# Altium project 学习型红外转发器.PrjPcb
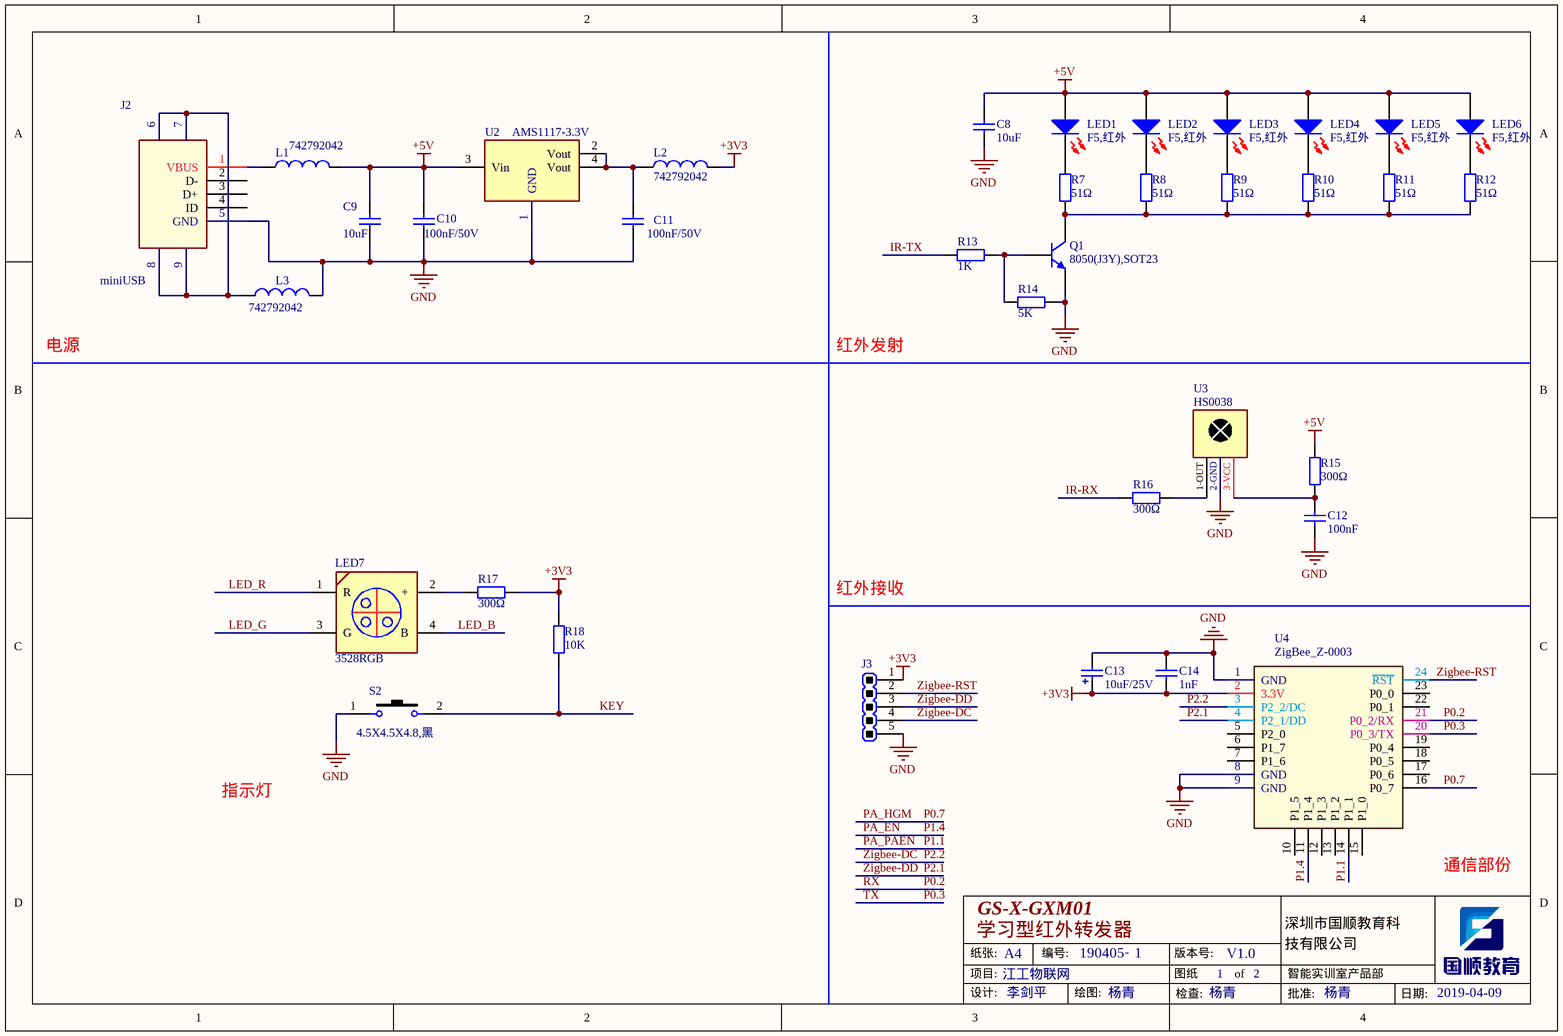
[diagram p0: 学习型红外转发器.SchDoc]
2 sheets, 53 parts. Net scope: global (net labels, ports and power ports of the same name join across sheets).
Board file: 学习型红外转发器.PcbDoc
Sheets:
  学习型红外转发器.SchDoc
  学习型红外转发器-MCU.SchDoc

## Sheet 学习型红外转发器.SchDoc: 学习型红外转发器
size A4; Organization: 智能实训室产品部; Address1: 广东省深圳市; Address2: 宝安区石岩凯普达工业园; DocumentNumber: 190405; Revision: V1.0; SheetNumber: 1; SheetTotal: 2; Date: 2019-04-09; ApprovedBy: 杨青; CheckedBy: 杨青; DrawnBy: 杨青; Engineer: 李剑平; ProjectName_GTA: 江工物联网; PCB Number: GS-X-GXM01

### Parts
C8  10uF  [C0603]
C9  10uF  [C0603]
C10  100nF/50V  [C0603]
C11  100nF/50V  [C0603]
C12  100nF  [C0603]
C13  10uF/25V  [TC3528X21B]
C14  1nF  [C0603]
J2  miniUSB  [USB mini/SM0.8-6H5]
J3  HDRM-1*5-2.54-AK  [HDRM-2.54-1*5P-AK1]  (value not drawn)  (no BOM)
L1  742792042  [L0805]
L2  742792042  [L0805]
L3  742792042  [L0805]
LED1  F5,红外  [IR-F5-V]
LED2  F5,红外  [IR-F5-V]
LED3  F5,红外  [IR-F5-V]
LED4  F5,红外  [IR-F5-V]
LED5  F5,红外  [IR-F5-V]
LED6  F5,红外  [IR-F5-V]
LED7  3528RGB  [LED_3528RGB]
Q1  8050(J3Y),SOT23  [SOT23]
R7  51Ω  [R0603]
R8  51Ω  [R0603]
R9  51Ω  [R0603]
R10  51Ω  [R0603]
R11  51Ω  [R0603]
R12  51Ω  [R0603]
R13  1K  [R0603]
R14  5K  [R0603]
R15  300Ω  [R0603]
R16  300Ω  [R0603]
R17  300Ω  [R0603]
R18  10K  [R0603]
S2  4.5X4.5X4.8,黑  [SW2-4.5*4.5*4.8MM-Side-BK]
U2  AMS1117-3.3V  [SOT-223]
U3  HS0038  [HS0038-H]
U4  ZigBee_Z-0003  [Module_ZigBee_Z-0003]

### Nets
+3V3: C13.1 C14.1 J3.1 L2.2 R17.1 R18.1 U4.2(3.3V)
+5V: C8.1 C9.1 C10.1 L1.2 LED1.1(A) LED2.1(A) LED3.1(A) LED4.1(A) LED5.1(A) LED6.1(A) R15.2 U2.3(Vin)
GND: C8.2 C9.2 C10.2 C11.2 C12.2 C13.2 C14.2 J2.5(GND) J3.5 L3.2 Q1.2(E) R14.2 S2.1 U2.1(GND) U3.2(GND) U4.1(GND) U4.8(GND) U4.9(GND)
IR-RX: R16.1
IR-TX: R13.1
KEY: R18.2 S2.2
LED_B: LED7.4(B)
LED_G: LED7.3(G)
LED_R: LED7.1(R)
P0.2: U4.21(P0_2/RX)  [also labelled RX]
P0.3: U4.20(P0_3/TX)  [also labelled TX]
P0.7: U4.16(P0_7)  [also labelled PA_HGM]
P1.1: U4.14(P1_1)  [also labelled PA_PAEN]
P1.4: U4.11(P1_4)  [also labelled PA_EN]
P2.1: J3.3 U4.4(P2_1/DD)  [also labelled Zigbee-DD]
P2.2: J3.4 U4.3(P2_2/DC)  [also labelled Zigbee-DC]
Zigbee-RST: J3.2 U4.24(~{RST})
NetC11_1: C11.1 L2.1 U2.2(Vout) U2.4(Vout)
NetC12_1: C12.1 R15.1 U3.3(VCC)
NetJ2_1: J2.1(VBUS) L1.1
NetJ2_6: J2.6 J2.7 J2.8 J2.9 L3.1
NetLED1_2: LED1.2(K) R7.2
NetLED2_2: LED2.2(K) R8.2
NetLED3_2: LED3.2(K) R9.2
NetLED4_2: LED4.2(K) R10.2
NetLED5_2: LED5.2(K) R11.2
NetLED6_2: LED6.2(K) R12.2
NetLED7_2: LED7.2(+) R17.2
NetQ1_1: Q1.1(B) R13.2 R14.1
NetQ1_3: Q1.3(C) R7.1 R8.1 R9.1 R10.1 R11.1 R12.1
NetR16_2: R16.2 U3.1(out)

Not connected (* = marked no-connect by the designer): J2 2(D-) 3(D+) 4(ID); U4 5(P2_0) 6(P1_7) 7(P1_6) 10(P1_5) 12(P1_3) 13(P1_2) 15(P1_0) 17(P0_6) 18(P0_5) 19(P0_4) 22(P0_1) 23(P0_0)

### Notes on the sheet
- 电源
- 红外发射
- 红外接收
- 指示灯
- (near U4) 通信部份
- 纸张:
- 项目:
- A4
- 编号:
- -
- 版本号:
- 图纸
- of
- 深圳市国顺教育科
- 技有限公司
- 设计:
- 绘图:
- 检查:
- 批准:
- 日期:
- (in symbol HS0038) 1-OUT; 2-GND; 3-VCC

### Library data of the parts
C8 C9 = 10uF_16V_0603: Capacitor; 编码: 无; 规格/型号: 10uF,16V,0603; 物料名称: 贴片电容
C10-C12 = 100nF_50V_0603: Capacitor; 编码: 无; 规格/型号: 100nF,50V,0603; 物料名称: 贴片电容
C13 = CAPC-10uF/25V_3528B: 钽电容,10uF/25V-3528B; 编码: 1010202012; 物料名称: 贴片钽电容; 规格/型号: 钽电容,10uF,25V,3528,B型
C14 = 1nF_50V_0603: Capacitor; 编码: 无; 规格/型号: 1nF,50V,0603; 物料名称: 贴片电容
J2 = USB-mini-5PF: mini-USB 5PF USB 母座; 规格/型号: mini-USB 5PF,贴片T型,USB 母座,USB-5002; 物料名称: USB接口; 单价: 0.1; 供应商: https://item.taobao.com/item.htm?id=42475441054&ali_refid=a3_420434_1006:1104662507:N:usb+mini:d1ba3785cc0cd36a97b12c38263ecbb3&ali_trackid=1_d1ba3785cc0cd36a97b12c38263ecbb3&spm=a230r.1.1957635.13
J3 = HDRM-1*5-2.54-AK: 排针,直; 规格/型号: 排针,间距2.54,1*5P,180°直插; 物料名称: 排针
L1-L3 = BEAD-742792042_0805: WE-CBF,600@100M,500Ohm,200mA,0805,742792042; 品牌: WE; 物料名称: 贴片磁珠; 规格/型号: WE-CBF,磁珠,600@100M，500Ohm,200mA,0805,742792042; 单价: 0.04
LED1-LED6 = LED-IR_F5: 红外发射; 规格/型号: F5,圆头,红外发射; 物料名称: 直插二极管
LED7 = RGB_3528: 3528,LED RGB; 规格/型号: 3528贴片LED红蓝绿三色七彩雾状灯珠,20mA; 物料名称: 贴片发光二极管; 单价: 0.125; 参数: R:2.0-2.2  G:3.0-3.2 B:3.0-3.2; 供应商: https://detail.tmall.com/item.htm?id=569373898165&ali_refid=a3_430583_1006:1110290364:N:LED%20RGB%203528:b82c81972ee6bbf0f7d8655d7a2e02d6&ali_trackid=1_b82c81972ee6bbf0f7d8655d7a2e02d6&spm=a230r.1.14.1
Q1 = NPN_8050(J3Y)_SOT23: NPN,8050,SOT23; 编码: 1010401001; 规格/型号: NPN,8050,标字J3Y,SOT23; 物料名称: 贴片三极管
R7-R12 = 51Ω_5%_0603: 51Ω,±5%,0603; 物料名称: 贴片电阻; 单价: 0.02; 规格/型号: 51Ω,±5%,0603; 参数: ±5%
R13 = 1K_5%_0603: 1K,±5%,0603; 编码: 1010101190; 物料名称: 贴片电阻; 单价: 0.02; 规格/型号: 1K,±5%,0603
R14 = 5K_5%_0603: 5K,±5%,0603; 物料名称: 贴片电阻; 单价: 0.02; 规格/型号: 5K,±5%,0603
R15-R17 = 300Ω_5%_0603: 300Ω,±5%,0603; 物料名称: 贴片电阻; 单价: 0.02; 规格/型号: 300Ω,±5%,0603
  R15 R16: 参数: ±5%
R18 = 10K_5%_0603: 10K,±5%,0603; 物料名称: 贴片电阻; 单价: 0.02; 规格/型号: 10K,±5%,0603
S2 = SW-PB_4.5X4.5X4.8-3P-SIDE-BK: 4.5X4.5X4.8,侧按3P,黑; 编码: 无; 物料名称: 贴片式轻触开关; 单价: 0.25; 供应商: https://detail.tmall.com/item.htm?spm=a230r.1.14.13.2b5b6ed7J7ZdZk&id=521248158918&cm_id=140105335569ed55e27b&abbucket=13; 规格/型号: 4.5X4.5X4.8,侧按3P,黑
U2 = AMS1117-3.3V_SOT223: 三端稳压器; 编码: 1010402018; 规格/型号: AMS1117-3.3,SOT-223; 物料名称: 贴片稳压芯片; 单价: 0.18
U3 = HS0038: 一体红外接收头; 编码: 1012001008; 规格/型号: HS0038,一体红外接收头,小圆头,2.5MM,黑色,3脚; 供应商: https://item.taobao.com/item.htm?spm=a1z09.2.0.0.2a4e7746xLRNWW&id=522575401769&_u=p65bp1a427f; 物料名称: 一体红外接收头
U4 = Module_ZigBee_Z-0003: zigbee模块; 品牌: 蜂汇; 规格/型号: ZigBee模块,TI CC2530F256,PCB天线,邮票板; 单价: 28; 供应商: https://item.taobao.com/item.htm?spm=a1z09.2.0.0.59a32e8dJHoI4V&id=20029637731&_u=c1sequth8fa8; 物料名称: zigbee模块

## Sheet 学习型红外转发器-MCU.SchDoc: 学习型红外转发器-MCU
size A4; Organization: 智能实训室产品部; Address1: 广东省深圳市; Address2: 宝安区石岩凯普达工业园; DocumentNumber: 190405; Revision: V1.0; SheetNumber: 2; SheetTotal: 2; Date: 2019-04-09; ApprovedBy: 杨青; CheckedBy: 杨青; DrawnBy: 杨青; Engineer: 李剑平; ProjectName_GTA: 江工物联网; PCB Number: GS-X-GXM01
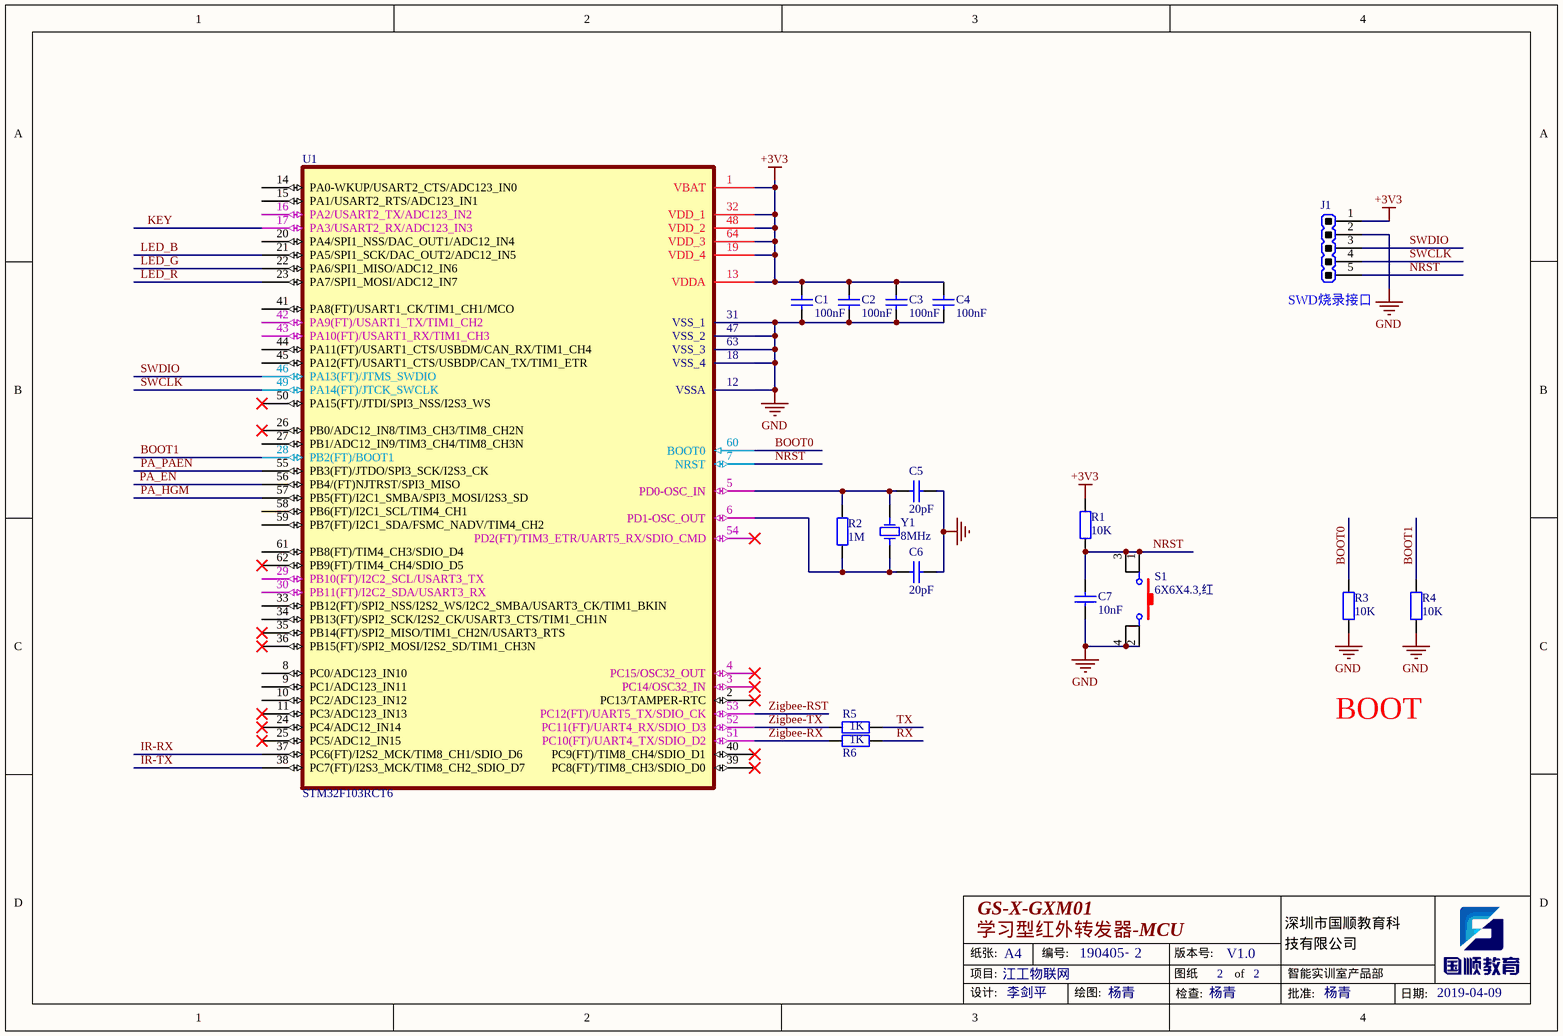
[diagram p1: 学习型红外转发器-MCU.SchDoc]

### Parts
C1  100nF  [C0603]
C2  100nF  [C0603]
C3  100nF  [C0603]
C4  100nF  [C0603]
C5  20pF  [C0603]
C6  20pF  [C0603]
C7  10nF  [C0603]
J1  HDRM-2.54/11-1*5P-AK  [HDRM-2.54-1*5P-AK]  (value not drawn)  (no BOM)
R1  10K  [R0603]
R2  1M  [R0603]
R3  10K  [R0603]
R4  10K  [R0603]
R5  1K  [R0603]
R6  1K  [R0603]
S1  6X6X4.3,红  [SW2-6.0X6.0X4.3-R-SMD]
U1  STM32F103RCT6  [LQFP64]
Y1  8MHz  [X_HC49-S]

### Nets
+3V3: C1.1 C2.2 C3.2 C4.2 J1.1 R1.1 U1.1(VBAT) U1.13(VDDA) U1.19(VDD_4) U1.32(VDD_1) U1.48(VDD_2) U1.64(VDD_3)
GND: C1.2 C2.1 C3.1 C4.1 C5.2 C6.2 C7.1 J1.2 R3.2 R4.2 S1.2 S1.4 U1.12(VSSA) U1.18(VSS_4) U1.31(VSS_1) U1.47(VSS_2) U1.63(VSS_3)
BOOT0: R3.1 U1.60(BOOT0)
BOOT1: R4.1 U1.28(PB2(FT)/BOOT1)
IR-RX: U1.37(PC6(FT)/I2S2_MCK/TIM8_CH1/SDIO_D6)
IR-TX: U1.38(PC7(FT)/I2S3_MCK/TIM8_CH2_SDIO_D7)
KEY: U1.17(PA3/USART2_RX/ADC123_IN3)
LED_B: U1.21(PA5/SPI1_SCK/DAC_OUT2/ADC12_IN5)
LED_G: U1.22(PA6/SPI1_MISO/ADC12_IN6)
LED_R: U1.23(PA7/SPI1_MOSI/ADC12_IN7)
NRST: C7.2 J1.5 R1.2 S1.1 S1.3 U1.7(NRST)
PA_EN: U1.56(PB4/(FT)NJTRST/SPI3_MISO)  [project net P1.4]
PA_HGM: U1.57(PB5(FT)/I2C1_SMBA/SPI3_MOSI/I2S3_SD)  [project net P0.7]
PA_PAEN: U1.55(PB3(FT)/JTDO/SPI3_SCK/I2S3_CK)  [project net P1.1]
RX: R6.1  [project net P0.2]
SWCLK: J1.4 U1.49(PA14(FT)/JTCK_SWCLK)
SWDIO: J1.3 U1.46(PA13(FT)/JTMS_SWDIO)
TX: R5.1  [project net P0.3]
Zigbee-RST: U1.53(PC12(FT)/UART5_TX/SDIO_CK)
Zigbee-RX: R6.2 U1.51(PC10(FT)/UART4_TX/SDIO_D2)
Zigbee-TX: R5.2 U1.52(PC11(FT)/UART4_RX/SDIO_D3)
NetC5_1: C5.1 R2.2 U1.5(PD0-OSC_IN) Y1.2
NetC6_1: C6.1 R2.1 U1.6(PD1-OSC_OUT) Y1.1

Not connected (* = marked no-connect by the designer): U1 2(PC13/TAMPER-RTC)* 3(PC14/OSC32_IN)* 4(PC15/OSC32_OUT)* 8(PC0/ADC123_IN10) 9(PC1/ADC123_IN11) 10(PC2/ADC123_IN12) 11(PC3/ADC123_IN13)* 14(PA0-WKUP/USART2_CTS/ADC123_IN0) 15(PA1/USART2_RTS/ADC123_IN1) 16(PA2/USART2_TX/ADC123_IN2) 20(PA4/SPI1_NSS/DAC_OUT1/ADC12_IN4) 24(PC4/ADC12_IN14)* 25(PC5/ADC12_IN15)* 26(PB0/ADC12_IN8/TIM3_CH3/TIM8_CH2N)* 27(PB1/ADC12_IN9/TIM3_CH4/TIM8_CH3N) 29(PB10(FT)/I2C2_SCL/USART3_TX) 30(PB11(FT)/I2C2_SDA/USART3_RX) 33(PB12(FT)/SPI2_NSS/I2S2_WS/I2C2_SMBA/USART3_CK/TIM1_BKIN) 34(PB13(FT)/SPI2_SCK/I2S2_CK/USART3_CTS/TIM1_CH1N) 35(PB14(FT)/SPI2_MISO/TIM1_CH2N/USART3_RTS)* 36(PB15(FT)/SPI2_MOSI/I2S2_SD/TIM1_CH3N)* 39(PC8(FT)/TIM8_CH3/SDIO_D0)* 40(PC9(FT)/TIM8_CH4/SDIO_D1)* 41(PA8(FT)/USART1_CK/TIM1_CH1/MCO) 42(PA9(FT)/USART1_TX/TIM1_CH2) 43(PA10(FT)/USART1_RX/TIM1_CH3) 44(PA11(FT)/USART1_CTS/USBDM/CAN_RX/TIM1_CH4) 45(PA12(FT)/USART1_CTS/USBDP/CAN_TX/TIM1_ETR) 50(PA15(FT)/JTDI/SPI3_NSS/I2S3_WS)* 54(PD2(FT)/TIM3_ETR/UART5_RX/SDIO_CMD)* 58(PB6(FT)/I2C1_SCL/TIM4_CH1) 59(PB7(FT)/I2C1_SDA/FSMC_NADV/TIM4_CH2) 61(PB8(FT)/TIM4_CH3/SDIO_D4) 62(PB9(FT)/TIM4_CH4/SDIO_D5)*

### Notes on the sheet
- (near J1) SWD烧录接口
- BOOT
- 纸张:
- 项目:
- A4
- 编号:
- -
- 版本号:
- 图纸
- of
- 深圳市国顺教育科
- 技有限公司
- 设计:
- 绘图:
- 检查:
- 批准:
- 日期:

### Library data of the parts
C1-C4 = 100nF_50V_0603: as C10 on sheet 学习型红外转发器
C5 C6 = 20pF_50V_0603: Capacitor; 编码: 无; 规格/型号: 20pF,50V,0603; 物料名称: 贴片电容
C7 = 10nF_16V_0603: Capacitor; 编码: 无; 规格/型号: 10nF,16V,0603; 物料名称: 贴片电容
J1 = HDRM-2.54/11-1*5P-AK: 排针,直; 规格/型号: 排针,间距2.54,针长11mm,1*5P,180°直插; 物料名称: 排针
R1 R3 R4 = 10K_5%_0603: 10K,±5%,0603; 物料名称: 贴片电阻; 单价: 0.02; 规格/型号: 10K,±5%,0603
  R3 R4: 参数: ±5%
R2 = 1M_5%_0603: 1M,±5%,0603; 物料名称: 贴片电阻; 单价: 0.02; 规格/型号: 1M,±5%,0603; 参数: ±5%
R5 R6 = 1K_5%_0603: as R13 on sheet 学习型红外转发器; 规格/型号: 1K,±5%,0603; 参数: ±5%
S1 = SW-PB_6X6X4.3-4P-R-SMD: 6X6X4.3,红,贴片; 规格/型号: 轻触开关,6*6*4.3mm,4PIN,红色,贴片; 物料名称: 贴片轻触开关; 供应商: https://item.taobao.com/item.htm?id=40753584004&ali_refid=a3_430582_1006:1107660778:N:%E8%BD%BB%E8%A7%A6%E5%BC%80%E5%85%B3+4%E8%84%9A:8617e68bea4bb3f9b632d97741335970&ali_trackid=1_8617e68bea4bb3f9b632d97741335970&spm=a230r.1.14.1#detail
U1 = STM32F103RCT6-LQFP64_1: ARM Cortex-M3 32-bit MCU, 256 KB Flash, 48 KB Internal RAM, 51 I/Os, 64-pin LQFP, -40 to 85 degC, Tray; 物料名称: 贴片芯片; 编码: 1010501255; 规格/型号: STM32F103RCT6,LQFP64
Y1 = CRYSTAL_8M_HC49S: 8MHz,HC-49S; 编码: 1011201001; 规格/型号: 8MHz,HC-49S,插针式; 物料名称: 直插无源晶振

## Nets that join several sheets
+3V3: 学习型红外转发器 (7 pins), 学习型红外转发器-MCU (12 pins)
GND: 学习型红外转发器 (18 pins), 学习型红外转发器-MCU (17 pins)
IR-RX: 学习型红外转发器 (R16.1), 学习型红外转发器-MCU (U1.37)
IR-TX: 学习型红外转发器 (R13.1), 学习型红外转发器-MCU (U1.38)
KEY: 学习型红外转发器 (R18.2 S2.2), 学习型红外转发器-MCU (U1.17)
LED_B: 学习型红外转发器 (LED7.4), 学习型红外转发器-MCU (U1.21)
LED_G: 学习型红外转发器 (LED7.3), 学习型红外转发器-MCU (U1.22)
LED_R: 学习型红外转发器 (LED7.1), 学习型红外转发器-MCU (U1.23)
P0.2: 学习型红外转发器 (U4.21), 学习型红外转发器-MCU (R6.1)
P0.3: 学习型红外转发器 (U4.20), 学习型红外转发器-MCU (R5.1)
P0.7: 学习型红外转发器 (U4.16), 学习型红外转发器-MCU (U1.57)
P1.1: 学习型红外转发器 (U4.14), 学习型红外转发器-MCU (U1.55)
P1.4: 学习型红外转发器 (U4.11), 学习型红外转发器-MCU (U1.56)
Zigbee-RST: 学习型红外转发器 (J3.2 U4.24), 学习型红外转发器-MCU (U1.53)